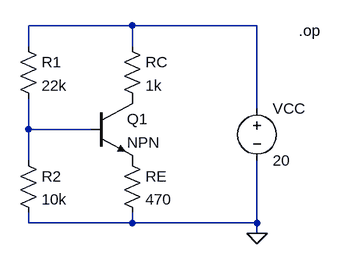
[diagram p0: schematic P1.asc]
P1.asc, the LTspice schematic file:
Version 4
SHEET 1 880 680
WIRE 320 -64 160 -64
WIRE 512 -64 320 -64
WIRE 160 -32 160 -64
WIRE 320 -32 320 -64
WIRE 512 64 512 -64
WIRE 160 96 160 48
WIRE 256 96 160 96
WIRE 160 144 160 96
WIRE 160 240 160 224
WIRE 320 240 320 224
WIRE 320 240 160 240
WIRE 512 240 512 144
WIRE 512 240 320 240
WIRE 512 256 512 240
FLAG 512 256 0
SYMBOL voltage 512 48 R0
SYMATTR InstName VCC
SYMATTR Value 20
SYMBOL res 304 -48 R0
SYMATTR InstName RC
SYMATTR Value 1k
SYMBOL res 144 -48 R0
SYMATTR InstName R1
SYMATTR Value 22k
SYMBOL res 144 128 R0
SYMATTR InstName R2
SYMATTR Value 10k
SYMBOL res 304 128 R0
SYMATTR InstName RE
SYMATTR Value 470
SYMBOL npn 256 48 R0
SYMATTR InstName Q1
TEXT 576 -56 Left 2 !.op

The netlist it stands for:
* P1.asc
VCC N001 0 20
RC N001 P001 1k
R1 N001 N002 22k
R2 N002 0 10k
RE P002 0 470
Q1 P001 N002 P002 0 NPN
.model NPN NPN
.model PNP PNP
.lib standard.bjt
.op
.backanno
.end